# EAGLE design mphase (EAGLE 9.6.2)
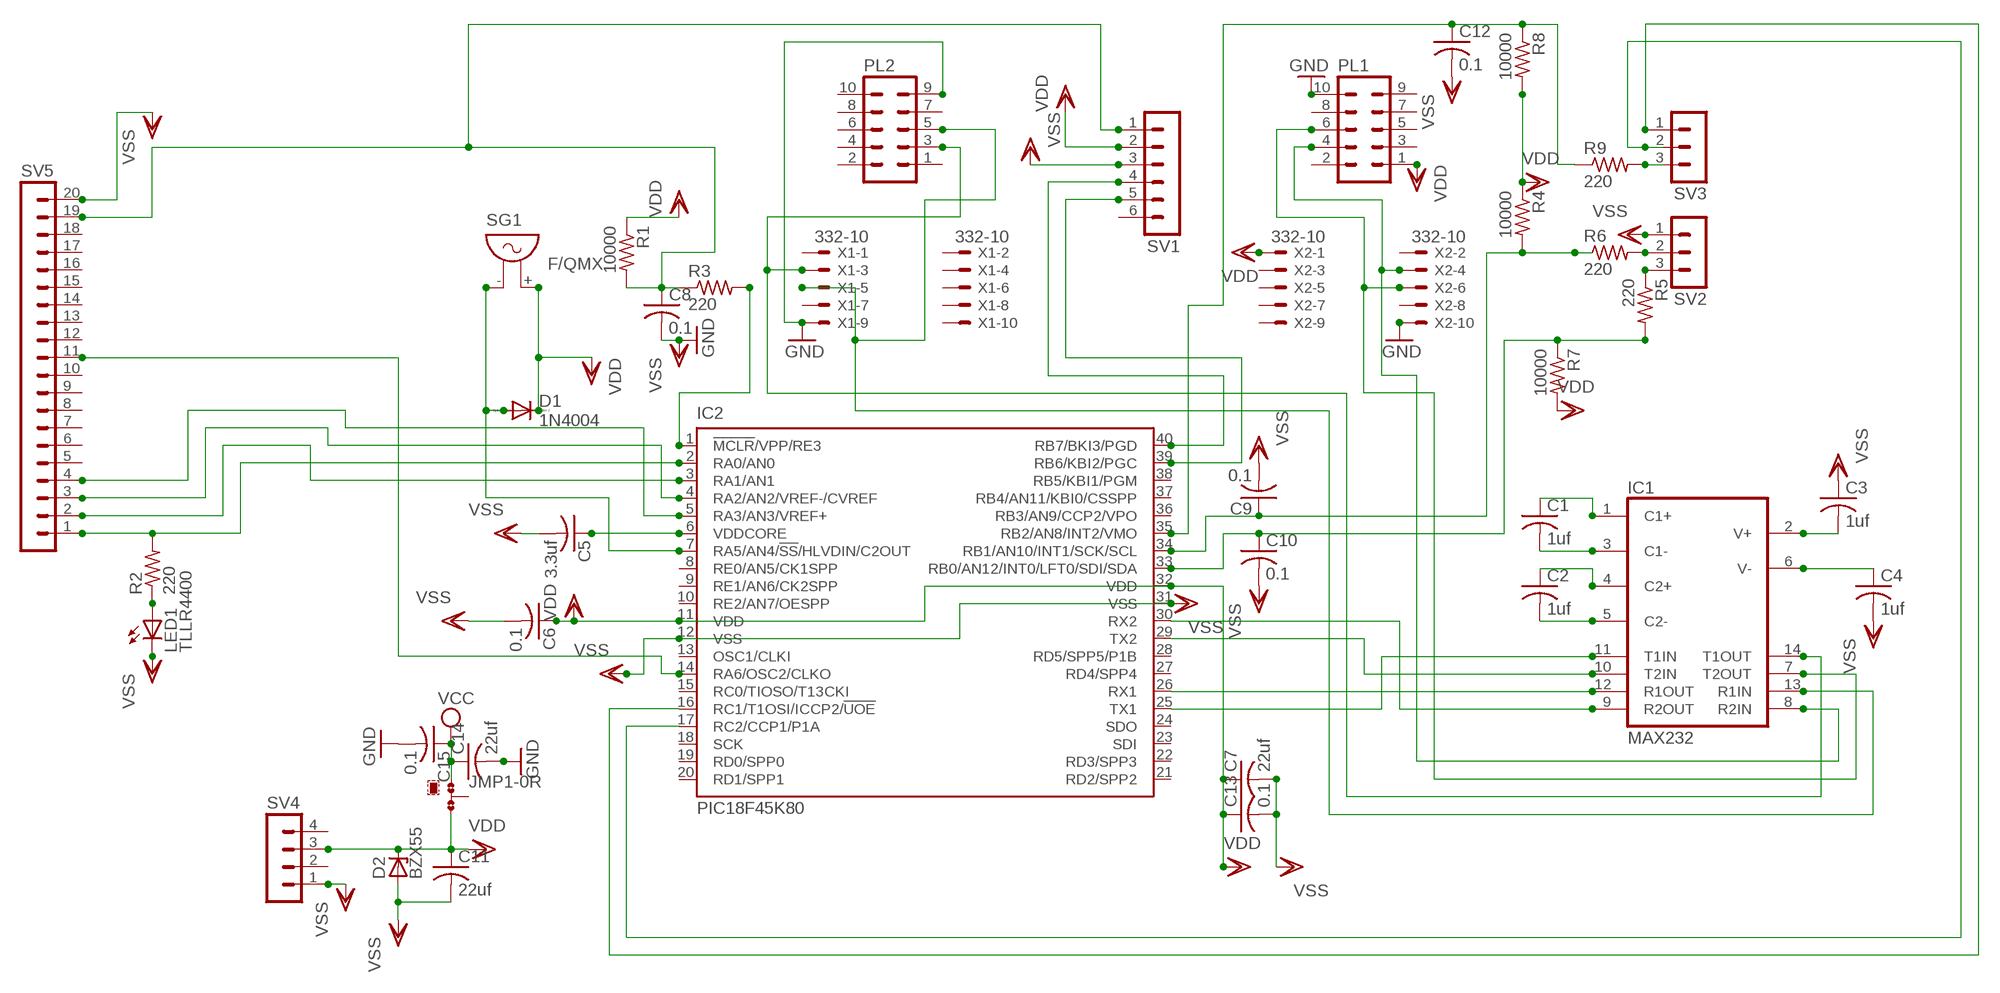
[diagram p0: schematic, sheet 1]

## Parts
C1  1uf  C-US025-025X050  [C025-025X050]
C2  1uf  C-US025-025X050  [C025-025X050]
C3  1uf  C-US025-025X050  [C025-025X050]
C4  1uf  C-US025-025X050  [C025-025X050]
C5  3.3uf  C-US025-025X050  [C025-025X050]
C6  0.1  C-US025-025X050  [C025-025X050]
C7  22uf  C-US025-025X050  [C025-025X050]
C8  0.1  C-US025-024X044  [C025-024X044]
C9  0.1  C-US025-024X044  [C025-024X044]
C10  0.1  C-US025-024X044  [C025-024X044]
C11  22uf  C-US025-025X050  [C025-025X050]
C12  0.1  C-US025-024X044  [C025-024X044]
C13  0.1  C-US025-024X044  [C025-024X044]
C14  22uf  C-US025-025X050  [C025-025X050]
C15  0.1  C-US025-025X050  [C025-025X050]
D1  1N4004  [DO41-10]
D2  BZX55  [DO35Z10]
IC1  MAX232  [DIL16]
IC2  PIC18F45K80  PIC18F4455_40  [DIL40]
JMP1  0R-JUMPA  [A0R-JMP]
LED1  TLLR4400  [LED3MM]
PL1  10H  [10H]
PL2  10H  [10H]
R1  10000  R-US_0204/2V  [0204V]
R2  220  R-US_0204/2V  [0204V]
R3  220  R-US_0204/2V  [0204V]
R4  10000  R-US_0204/2V  [0204V]
R5  220  R-US_0204/2V  [0204V]
R6  220  R-US_0204/2V  [0204V]
R7  10000  R-US_0204/2V  [0204V]
R8  10000  R-US_0204/2V  [0204V]
R9  220  R-US_0204/2V  [0204V]
SG1  F/QMX  [F/QMX]
SV1  MA06-1  [MA06-1]
SV2  MA03-1  [MA03-1]
SV3  MA03-1  [MA03-1]
SV4  MA04-1  [MA04-1]
SV5  MA20-1  [MA20-1]
X1  332-10  [332-10]
X2  332-10  [332-10]

## Nets
GND: C8.2 C14.2 C15.2 PL1.10 PL2.9 X1.9 X2.10 ; supply symbol labelled VSS
N$1: C1.2 IC1.3(C1-)
N$2: C2.2 IC1.5(C2-)
N$3: C2.1 IC1.4(C2+)
N$4: C1.1 IC1.1(C1+)
N$5: C3.2 IC1.2(V+)
N$6: C4.1 IC1.6(V-)
N$7: D1.A IC2.7(RA5/AN4/!SS!/HLVDIN/C2OUT) SG1.-
N$8: C8.1 R1.2 R3.1 SV1.1 SV5.19
N$9: C5.1 IC2.6(VDDCORE)
N$10: IC1.10(T2IN) IC2.29(TX2)
N$11: IC1.11(T1IN) IC2.25(TX1)
N$12: IC1.12(R1OUT) IC2.26(RX1)
N$13: IC1.9(R2OUT) IC2.30(RX2)
N$14: IC2.1(!MCLR!/VPP/RE3) R3.2
N$15: IC2.2(RA0/AN0) R2.2 SV5.1
N$16: IC1.7(T2OUT) PL1.6 X2.6
N$17: IC1.8(R2IN) PL1.4 X2.4
N$18: LED1.A R2.1
N$19: IC1.14(T1OUT) PL2.3 X1.3
N$20: IC1.13(R1IN) PL2.5 X1.5
N$21: C9.1 IC2.34(RB1/AN10/INT1/SCK/SCL) R4.2 R6.1
N$22: C10.1 IC2.33(RB0/AN12/INT0/LFT0/SDI/SDA) R5.2 R7.1
N$23: IC2.3(RA1/AN1) SV5.2
N$24: R6.2 SV2.2
N$25: R5.1 SV2.3
N$26: IC2.4(RA2/AN2/VREF-/CVREF) SV5.3
N$27: IC2.5(RA3/AN3/VREF+) SV5.4
N$28: C12.1 IC2.35(RB2/AN8/INT2/VMO) R8.1 R9.1
N$29: IC2.40(RB7/BKI3/PGD) SV1.4
N$30: IC2.14(RA6/OSC2/CLKO) SV5.11
N$31: R9.2 SV3.3
N$32: IC2.39(RB6/KBI2/PGC) SV1.5
N$33: IC2.16(RC1/T1OSI/ICCP2/!UOE) SV3.1
N$34: IC2.17(RC2/CCP1/P1A) SV3.2
VCC: C14.1 C15.1 JMP1.1
VDD: C6.1 C7.1 C11.1 C13.1 D1.C D2.C IC2.11(VDD) IC2.32(VDD) JMP1.3 PL1.1 R1.1 R4.1 R7.2 R8.2 SG1.+ SV1.2 SV4.3 X2.1
VSS: C3.1 C4.2 C5.2 C6.2 C7.2 C9.2 C10.2 C11.2 C12.2 C13.2 D2.A IC2.12(VSS) IC2.31(VSS) LED1.K(C) SV1.3 SV2.1 SV4.1 SV5.20
Unconnected: IC2.8(RE0/AN5/CK1SPP) IC2.9(RE1/AN6/CK2SPP) IC2.10(RE2/AN7/OESPP) IC2.13(OSC1/CLKI) IC2.15(RC0/TIOSO/T13CKI) IC2.18(SCK) IC2.19(RD0/SPP0) IC2.20(RD1/SPP1) IC2.21(RD2/SPP2) IC2.22(RD3/SPP3) IC2.23(SDI) IC2.24(SDO) IC2.27(RD4/SPP4) IC2.28(RD5/SPP5/P1B) IC2.36(RB3/AN9/CCP2/VPO) IC2.37(RB4/AN11/KBI0/CSSPP) IC2.38(RB5/KBI1/PGM) JMP1.2 PL1.2 PL1.3 PL1.5 PL1.7 PL1.8 PL1.9 PL2.1 PL2.2 PL2.4 PL2.6 PL2.7 PL2.8 PL2.10 SV1.6 SV4.2 SV4.4 SV5.5 SV5.6 SV5.7 SV5.8 SV5.9 SV5.10 SV5.12 SV5.13 SV5.14 SV5.15 SV5.16 SV5.17 SV5.18 X1.1 X1.2 X1.4 X1.6 X1.7 X1.8 X1.10 X2.2 X2.3 X2.5 X2.7 X2.8 X2.9

## Power pins joined to a net without a drawn wire
GND: IC1.15(GND)
VCC: IC1.16(VCC)

## Library data of the parts
C1-C15 = resistor:C-US: CAPACITOR, American symbol
D1 = diode:1N4004: DIODE general purpose rectifier, 1 A
D2 = diode:BZX55: Z DIODE
IC1 = maxim:MAX232: RS232 TRANSCEIVER; MF: MAXIM; MPN: MAX232ACPE+; OC_FARNELL: 9723773; OC_NEWARK: 68K4544
IC2 = microchip:PIC18F4*_40: USB Microcontrollers with nanoWatt Technology High-Performance, Enhanced Flash, 28/40/44-Pin, Source: http://ww1.microchip.com/downloads/en/devicedoc/39632c.pdf; MF: MICROCHIP; MPN: PIC18F45K80; OC_FARNELL: 9321314; OC_NEWARK: 05K2028
JMP1 = jump-0r-smd:0R-JUMP: SMD 0R 0805 Jumper
LED1 = led:TLLR4400: Low Current (2mA) LED 3 mm Tinted Diffused Package color RED Source: Data sheet <http://www.farnell.com/datasheets/391100.pdf>; MF: VISHAY SEMICONDUCTOR; OC_FARNELL: 1612437
PL1 PL2 = con-harting-h:10H: CONNECTOR; OC_FARNELL: unknown; OC_NEWARK: unknown
R1-R9 = resistor:R-US_: RESISTOR, American symbol
SG1 = buzzer:F/QMX: BUZZER Source: Buerklin; OC_FARNELL: unknown; OC_NEWARK: unknown
SV1 = con-lstb:MA06-1: PIN HEADER; OC_FARNELL: unknown; OC_NEWARK: unknown
SV2 SV3 = con-lstb:MA03-1: PIN HEADER; OC_FARNELL: unknown; OC_NEWARK: unknown
SV4 = con-lstb:MA04-1: PIN HEADER; OC_FARNELL: unknown; OC_NEWARK: unknown
SV5 = con-lstb:MA20-1: PIN HEADER; OC_FARNELL: unknown; OC_NEWARK: unknown
X1 X2 = con-garry:332-10: 10 Pin - 2mm Dual Row Source: www.mpe-connector.de / garry_shortform_2012.pdf

## Board
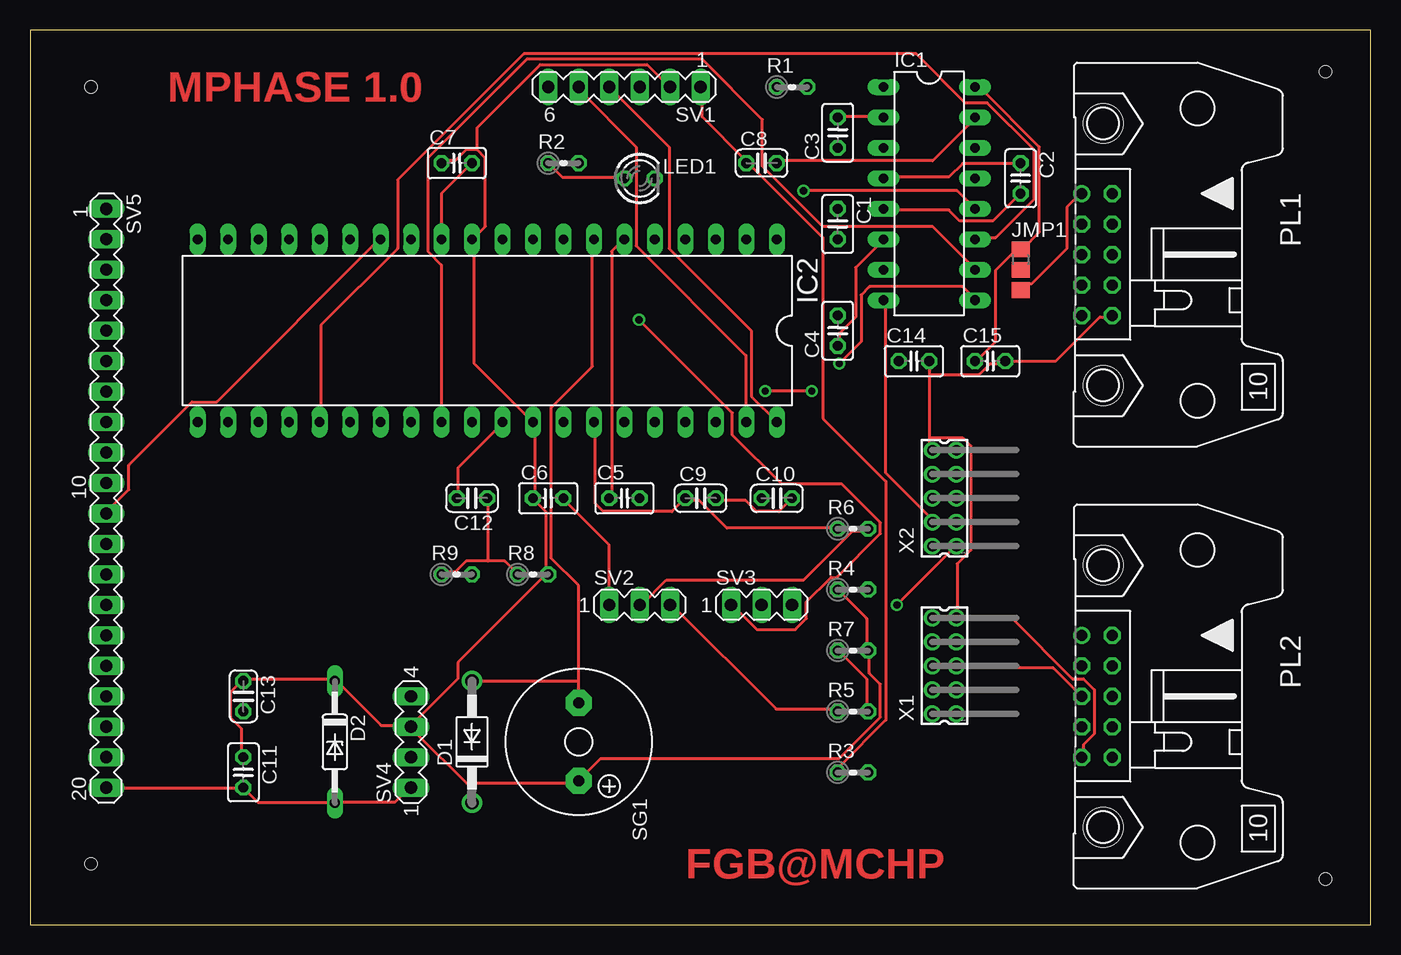
[diagram p1: board, top side]
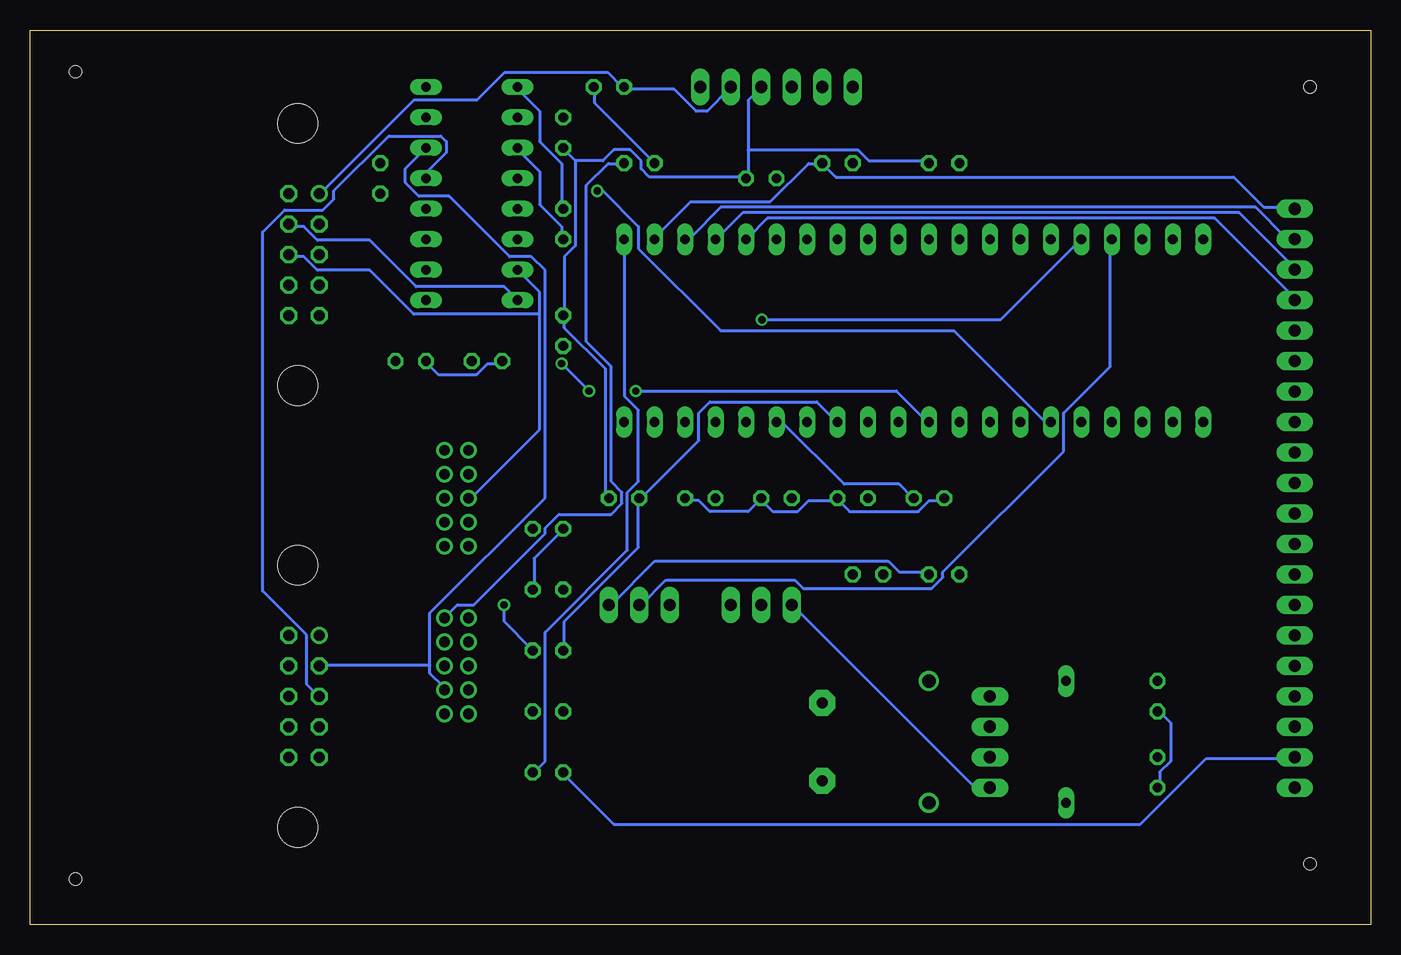
[diagram p2: board, bottom side, seen from below]

Size 111.74 x 74.6 mm. Coordinates in mm from the lower left corner, seen from the top.
Outline: 0,0 111.74,0 111.74,74.6 0,74.6 0,0
Copper layers (1*16): Top 0.035mm / dielectric 1.5mm / Bottom 0.035mm
Design rules "default": minimum track width 10mil, minimum drill 24mil, track to track 8mil, track to pad 8mil, pad to pad 8mil, via to via 8mil, smd to smd 8mil, copper to edge 40mil, drill to drill 8mil, minimum pad ring 10mil, minimum via ring 8mil, stop-mask expansion 4mil, vias tented up to drill 0mil, thermal gap 10mil
Holes 1 mm at 5.08,69.85 5.08,5.08 107.95,3.81 107.95,71.12

### Footprints (pad centres in the part's own frame; a part is rotated, then mirrored left to right if it is on the bottom)
C025-025X050 = drill 0.813 octagon: 1 -1.27,0; 2 1.27,0
C025-024X044 = drill 0.813 octagon: 1 -1.27,0; 2 1.27,0
DO41-10 = drill 1.118: A 5.08,0; C -5.08,0
DO35Z10 = drill 0.813 long: A 5.08,0; C -5.08,0
DIL16 = drill 0.813 long: 1 -8.89,-3.81; 2 -6.35,-3.81; 3 -3.81,-3.81; 4 -1.27,-3.81; 5 1.27,-3.81; 6 3.81,-3.81; 7 6.35,-3.81; 8 8.89,-3.81; 9 8.89,3.81; 10 6.35,3.81; 11 3.81,3.81; 12 1.27,3.81; 13 -1.27,3.81; 14 -3.81,3.81; 15 -6.35,3.81; 16 -8.89,3.81
DIL40 = drill 0.813 long: 1 -24.13,-7.62; 2 -21.59,-7.62; 3 -19.05,-7.62; 4 -16.51,-7.62; 5 -13.97,-7.62; 6 -11.43,-7.62; 7 -8.89,-7.62; 8 -6.35,-7.62; 9 -3.81,-7.62; 10 -1.27,-7.62; 11 1.27,-7.62; 12 3.81,-7.62; 13 6.35,-7.62; 14 8.89,-7.62; 15 11.43,-7.62; 16 13.97,-7.62; 17 16.51,-7.62; 18 19.05,-7.62; 19 21.59,-7.62; 20 24.13,-7.62; 21 24.13,7.62; 22 21.59,7.62; 23 19.05,7.62; 24 16.51,7.62; 25 13.97,7.62; 26 11.43,7.62; 27 8.89,7.62; 28 6.35,7.62; 29 3.81,7.62; 30 1.27,7.62; 31 -1.27,7.62; 32 -3.81,7.62; 33 -6.35,7.62; 34 -8.89,7.62; 35 -11.43,7.62; 36 -13.97,7.62; 37 -16.51,7.62; 38 -19.05,7.62; 39 -21.59,7.62; 40 -24.13,7.62
A0R-JMP = smd 1.5 x 1.3: 1 0,1.7; 2 0,0; 3 0,-1.7
LED3MM = drill 0.813 octagon: A -1.27,0; K 1.27,0
10H = drill 0.914: 1 -5.08,-1.27 | drill 0.914 octagon: 2 -5.08,1.27; 3 -2.54,-1.27; 4 -2.54,1.27; 5 0,-1.27; 6 0,1.27; 7 2.54,-1.27; 8 2.54,1.27; 9 5.08,-1.27; 10 5.08,1.27 | hole 3.302: -10.922,0.533; 10.922,0.533
0204V = drill 0.813 octagon: 1 -1.27,0; 2 1.27,0
F/QMX = drill 0.914 pad 2.159 octagon: + 3.251,0; - -3.251,0
MA06-1 = drill 1.016 long: 1 -6.35,0; 2 -3.81,0; 3 -1.27,0; 4 1.27,0; 5 3.81,0; 6 6.35,0
MA03-1 = drill 1.016 long: 1 -2.54,0; 2 0,0; 3 2.54,0
MA04-1 = drill 1.016 long: 1 -3.81,0; 2 -1.27,0; 3 1.27,0; 4 3.81,0
MA20-1 = drill 1.016 long: 1 -24.13,0; 2 -21.59,0; 3 -19.05,0; 4 -16.51,0; 5 -13.97,0; 6 -11.43,0; 7 -8.89,0; 8 -6.35,0; 9 -3.81,0; 10 -1.27,0; 11 1.27,0; 12 3.81,0; 13 6.35,0; 14 8.89,0; 15 11.43,0; 16 13.97,0; 17 16.51,0; 18 19.05,0; 19 21.59,0; 20 24.13,0
332-10 = drill 0.9 pad 1.27: 1 -4,-1; 2 -4,1; 3 -2,-1; 4 -2,1; 5 0,-1; 6 0,1; 7 2,-1; 8 2,1; 9 4,-1; 10 4,1

### Placement (x,y rotation side)
C1  67.31,58.42 270 top
C2  82.55,62.23 270 top
C3  67.31,66.04 90 top
C4  67.31,49.53 90 top
C5  49.53,35.56 0 top
C6  43.18,35.56 0 top
C7  35.56,63.5 0 top
C8  60.96,63.5 0 top
C9  55.88,35.56 0 top
C10  62.23,35.56 0 top
C11  17.78,12.7 270 top
C12  36.83,35.56 180 top
C13  17.78,19.05 270 top
C14  73.66,46.99 0 top
C15  80.01,46.99 0 top
D1  36.83,15.24 90 top
D2  25.4,15.24 270 top
IC1  74.93,60.96 270 top
IC2  38.1,49.53 180 top
JMP1  82.55,54.61 0 top
LED1  50.8,62.23 0 top
PL1  88.9,55.88 270 top
PL2  88.9,19.05 270 top
R1  63.5,69.85 0 top
R2  44.45,63.5 0 top
R3  68.58,12.7 0 top
R4  68.58,27.94 0 top
R5  68.58,17.78 0 top
R6  68.58,33.02 0 top
R7  68.58,22.86 0 top
R8  41.91,29.21 0 top
R9  35.56,29.21 0 top
SG1  45.72,15.24 270 top
SV1  49.53,69.85 180 top
SV2  50.8,26.67 0 top
SV3  60.96,26.67 0 top
SV4  31.75,15.24 90 top
SV5  6.35,35.56 270 top
X1  76.2,21.59 90 top
X2  76.2,35.56 90 top

### Tracks (layer width: path | path; a pad name or v marks a point on that pad's centre or on a via)
GND
  Top 0.254: C8.2 62.41,63.7 75.21,63.7 78.64,67.13 IC1.15 | 74.98,40.62 74.98,39.7 X2.10 | 74.98,40.62 74.98,45.87 | 74.98,45.87 74.98,46.79 C14.2 | 74.98,45.87 79.1,45.87 80.01,46.79 81.15,46.79 C15.2 81.38,47.02 85.5,47.02 89.15,50.67 90.07,50.67 PL1.10 | 74.98,40.62 77.72,40.62 78.41,39.93 78.41,31.24 77.27,30.1 77.27,25.76 X1.9 77.27,25.53 81.84,25.53 86.87,20.5 87.78,20.5 88.7,19.58 88.7,15.93 87.78,15.01 87.78,14.1 PL2.9
  Bottom 0.254: C8.2 62.41,63.48 63.55,63.48 65.38,61.65 65.38,48.62 63.32,46.56 63.32,36.96 62.41,36.04 62.41,35.13 63.32,34.21 67.67,34.21 68.81,33.07 68.81,32.61 74.75,26.67 76.12,26.67 77.04,25.76 X1.9
N$1
  Bottom 0.254: C1.2 67.44,57.3 67.44,58.22 69.27,60.05 69.27,62.79 71.09,64.62 IC1.3
N$2
  Top 0.254: IC1.5 71.32,59.59 76.58,59.59 77.5,58.67 80.24,58.67 82.53,60.96 C2.2
N$3
  Top 0.254: IC1.4 71.32,62.33 76.58,62.33 77.72,63.48 82.53,63.48 C2.1
N$4
  Bottom 0.254: C1.1 67.44,59.82 67.44,63.48 69.27,65.3 69.27,67.82 71.09,69.65 IC1.1
N$5
  Top 0.254: C3.2 67.44,67.36 71.09,67.36 IC1.2
N$6
  Top 0.254: C4.1 67.44,48.39 67.44,49.3 68.81,50.67 68.81,54.79 71.09,57.07 IC1.6
N$7
  Top 0.254: SG1.- 45.72,20.27 | 45.72,20.27 45.72,28.27 43.43,30.56 43.43,43.13 46.86,46.56 46.86,57.07 IC2.7 | 45.72,20.27 37.03,20.27 D1.A
N$8
  Top 0.254: R3.1 67.44,12.72 67.44,13.18 71.32,17.07 71.32,36.96 66.06,42.22 66.06,57.3 59.89,63.48 C8.1 59.66,63.7 56.01,67.36 56.01,69.65 SV1.1
  Bottom 0.254: C8.1 64.69,68.5 64.69,69.65 R1.2 | SV5.19 6.4,13.87 13.72,13.87 19.2,8.38 63.09,8.38 67.21,12.5 R3.1
N$9
  Top 0.254: C5.1 48.46,35.59 48.46,56.16 49.38,57.07 IC2.6
N$10
  Top 0.254: IC2.29 34.29,55.02 33.15,56.16 33.15,63.93 41.38,72.16 56.01,72.16 61.04,67.13 61.04,63.25 66.06,58.22 75.21,58.22 78.64,54.79 IC1.10
N$11
  Top 0.254: IC2.25 24.23,41.99 24.23,49.99 30.63,56.39 30.63,62.1 41.15,72.62 73.84,72.62 77.95,68.5 79.78,68.5 83.67,64.62 83.67,60.5 80.47,57.3 78.87,57.3 IC1.11
N$12  (via drill 0.61)
  Top 0.254: v64.47,61.19 77.27,61.19 78.64,59.82 IC1.12
  Bottom 0.254: v64.47,61.19 64.01,61.19 61.04,58.22 61.04,56.39 54.18,49.53 34.75,49.53 27.2,41.99 26.75,41.99 IC2.26
N$13  (via drill 0.61)
  Top 0.254: v65.15,44.5 v61.27,44.5 | v67.44,46.79 69.27,48.62 69.27,52.5 69.95,53.19 77.72,53.19 78.64,52.27 IC1.9
  Bottom 0.254: v61.27,44.5 39.55,44.5 37.03,41.99 IC2.30 | v67.44,46.79 v65.15,44.5
N$14
  Bottom 0.254: IC2.1 62.18,57.07 62.18,44.04 61.04,42.9 61.04,36.96 61.95,36.04 61.95,31.24 68.81,24.38 68.81,13.64 69.72,12.72 R3.2
N$15
  Bottom 0.254: 45.72,63.48 46.86,63.48 50.06,60.27 56.69,60.27 59.66,57.3 IC2.2 | 45.72,63.48 44.58,62.33 11.43,62.33 8.91,59.82 6.4,59.82 SV5.1 | 45.72,63.48 R2.2
N$16
  Bottom 0.254: 69.27,50.9 69.27,41.3 74.98,35.59 X2.6 | 69.27,50.9 69.27,52.73 71.09,54.56 IC1.7 | 69.27,50.9 79.78,50.9 83.44,54.56 87.78,54.56 88.92,55.7 90.07,55.7 PL1.6
N$17
  Top 0.254: IC1.8 71.32,52.05 71.32,37.64 75.21,33.76 X2.4
  Bottom 0.254: IC1.8 72.24,53.19 79.55,53.19 83.44,57.07 87.78,57.07 88.92,58.22 90.07,58.22 PL1.4
N$18
  Top 0.254: R2.1 44.35,62.33 49.38,62.33 LED1.A
N$19
  Bottom 0.254: 78.41,21.64 78.41,20.95 77.27,19.81 X1.3 | 78.41,21.64 78.41,25.98 68.81,35.59 68.81,54.56 69.95,55.7 71.78,55.7 76.81,60.73 79.32,60.73 80.47,61.87 80.47,63.02 78.87,64.62 IC1.14 | 78.41,21.64 87.55,21.64 PL2.3
N$20
  Top 0.254: PL2.5 85.27,21.41 77.27,21.41 X1.5
  Bottom 0.254: IC1.13 78.64,62.33 78.64,62.79 77.04,64.39 77.04,65.3 77.5,65.76 81.84,65.76 86.41,61.19 86.41,60.5 87.33,59.59 90.53,59.59 92.35,57.76 92.35,27.81 88.7,24.15 88.7,20.04 87.78,19.13 PL2.5
N$21
  Top 0.254: R6.1 67.21,33.07 58.06,33.07 55.78,35.36 54.63,35.36 C9.1 53.49,34.44 47.78,34.44 47.09,35.13 47.09,41.76 IC2.34
  Bottom 0.254: R4.2 69.72,28.04 69.72,30.56 67.44,32.84 R6.1
N$22
  Top 0.254: R5.2 69.72,17.98 69.72,20.5 67.44,22.78 R7.1
  Bottom 0.254: R7.1 67.21,23.01 67.21,25.3 61.04,31.47 61.04,35.36 C10.1 60.81,35.59 56.01,40.39 56.01,42.67 55.09,43.59 46.18,43.59 44.58,41.99 IC2.33
N$23
  Bottom 0.254: IC2.3 57.15,57.3 56.69,57.3 54.18,59.82 9.6,59.82 7.09,57.3 6.4,57.3 SV5.2
N$24
  Top 0.254: R6.2 69.72,32.84 68.58,32.84 64.47,28.73 53.03,28.73 50.98,26.67 SV2.2
N$25
  Top 0.254: R5.1 67.21,17.98 62.18,17.98 53.49,26.67 SV2.3
N$26
  Bottom 0.254: IC2.4 54.41,57.3 52.35,59.36 10.97,59.36 6.4,54.79 SV5.3
N$27
  Bottom 0.254: IC2.5 51.89,57.3 50.29,58.9 13.03,58.9 6.4,52.27 SV5.4
N$28
  Top 0.254: 38.18,30.33 39.55,30.33 40.46,29.41 R8.1 | 38.18,30.33 36.35,30.33 35.43,29.41 34.29,29.41 R9.1 | 38.18,30.33 38.18,35.36 C12.1
  Bottom 0.254: IC2.35 49.38,41.76 48.92,41.76 43.89,36.73 39.32,36.73 38.18,35.59 C12.1
N$29
  Top 0.254: SV1.4 53.26,64.85 53.26,56.39 60.12,49.53 60.12,44.04 62.18,41.99 IC2.40
N$30
  Top 0.254: IC2.14 29.03,57.07 15.54,43.59 13.49,43.59 8.23,38.33 8.23,36.27 6.4,34.44 SV5.11
N$31
  Bottom 0.254: R9.2 37.03,29.41 39.32,29.41 40.23,30.33 59.66,30.33 63.32,26.67 SV3.3
N$32
  Top 0.254: IC2.39 59.66,41.99 59.66,47.47 50.52,56.62 50.52,64.85 45.72,69.65 SV1.5
N$33  (via drill 0.61)
  Top 0.254: v50.75,50.44 58.52,42.67 58.52,40.84 62.64,36.73 67.67,36.73 70.87,33.53 70.87,32.61 67.21,28.96 66.75,28.96 64.69,26.9 64.69,25.53 63.78,24.61 60.58,24.61 58.52,26.67 SV3.1
  Bottom 0.254: v50.75,50.44 30.86,50.44 24.23,57.07 IC2.16
N$34
  Bottom 0.254: IC2.17 21.72,57.07 21.72,46.56 25.6,42.67 25.6,39.47 35.66,29.41 35.66,28.96 36.58,28.04 47.32,28.04 48.01,28.73 58.75,28.73 60.81,26.67 SV3.2
VCC
  Top 0.254: C15.1 78.87,47.02 80.47,48.62 80.47,54.56 82.07,56.16 82.53,56.16 JMP1.1 82.75,56.39 84.12,57.76 84.12,64.85 79.32,69.65 78.87,69.65 IC1.16
  Bottom 0.254: C14.1 72.47,46.79 73.61,46.79 74.52,45.87 77.72,45.87 78.64,46.79 C15.1
VDD  (via drill 0.61)
  Top 0.254: R4.1 69.72,25.53 69.72,23.01 R7.2 69.95,22.78 69.95,20.95 70.87,20.04 70.87,17.3 67.44,13.87 47.55,13.87 45.72,12.04 SG1.+ 45.72,11.81 37.26,11.81 36.8,11.35 | v72.24,26.67 77.04,31.47 X2.1 | C11.1 17.6,14.1 17.6,16.38 16.69,17.3 16.69,19.36 17.6,20.27 C13.1 17.83,20.5 25.38,20.5 D2.C 25.6,20.27 29.26,16.61 31.55,16.61 SV4.3 | 36.8,11.35 36.8,10.21 D1.C | 36.8,11.35 31.77,16.38 SV4.3 | JMP1.3 82.75,52.96 83.21,53.42 83.44,53.42 86.41,56.39 86.41,59.82 87.55,60.96 PL1.1 | 37.26,64.62 36.35,64.62 35.43,63.7 34.29,63.7 C7.1 | 37.26,64.62 37.95,63.93 37.95,58.22 37.03,57.3 IC2.11 37.03,57.07 37.03,46.79 IC2.32 42.06,41.76 42.06,35.59 C6.1 42.06,35.36 42.98,34.44 42.98,29.41 R8.2 42.98,29.18 35.66,21.87 35.66,20.5 31.77,16.61 SV4.3 | 37.26,64.62 37.26,66.45 42.52,71.7 51.44,71.7 53.26,69.88 SV1.2
  Bottom 0.254: v72.24,26.67 72.24,25.3 69.95,23.01 R7.2 | SV1.2 53.49,69.65 55.32,67.82 56.24,67.82 58.06,69.65 62.18,69.65 R1.1 62.41,69.88 63.55,71.02 72.24,71.02 74.52,68.73 79.78,68.73 87.55,60.96 PL1.1
VSS
  Top 0.254: IC2.12 34.29,60.96 C7.2 | SV4.1 31.55,11.35 30.4,10.21 25.6,10.21 D2.A 25.38,10.21 18.97,10.21 17.83,11.35 C11.2 17.6,11.35 6.4,11.35 SV5.20 | C12.2 35.66,35.59 35.66,38.1 39.32,41.76 IC2.31 | C9.2 57.15,35.36 59.66,35.36 60.58,34.44 62.41,34.44 63.32,35.36 C10.2 | SV2.1 48.23,26.67 48.23,31.7 44.58,35.36 C6.2
  Bottom 0.254: 66.29,63.7 66.29,56.62 67.21,55.7 67.21,50.9 C4.2 67.21,50.67 67.21,49.76 63.78,46.33 63.78,35.81 63.55,35.59 C10.2 | 66.29,63.7 67.21,64.62 C3.1 | 51.89,64.62 51.89,68.73 50.98,69.65 SV1.3 | 51.89,64.62 51.89,62.33 LED1.K 52.12,62.33 60.12,62.33 60.81,63.02 60.81,63.7 61.72,64.62 63.09,64.62 64.01,63.7 66.29,63.7 | 51.89,64.62 42.75,64.62 41.83,63.7 37.03,63.7 C7.2 | C11.2 17.6,11.58 17.6,12.72 16.69,13.64 16.69,16.84 17.6,17.75 C13.2 | C9.2 57.15,35.36 56.01,35.36 55.09,34.44 51.89,34.44 50.98,35.36 C5.2 50.75,35.36 49.84,34.44 47.78,34.44 46.86,35.36 44.58,35.36 C6.2 44.35,35.36 43.43,34.44 37.72,34.44 36.8,35.36 35.66,35.36 C12.2 | SV4.1 31.77,11.58 33.15,11.58 48.23,26.67 SV2.1

### Text on the board
Top: MPHASE 1.0 | FGB@MCHP